# Altium schematic sheet FPGA_Project2.SchDoc
size A4
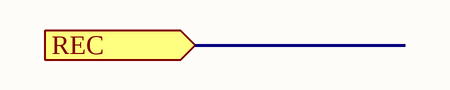
[diagram p0: FPGA_Project2.SchDoc]

## Ports
REC (in)